# Altium schematic sheet Debugger & I2C.SchDoc
size A4; SheetNumber: 6; SheetTotal: 9
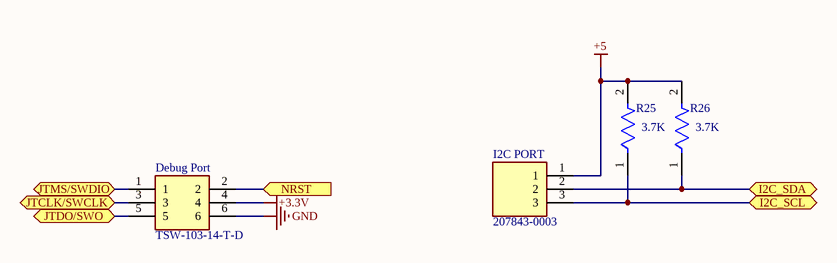
[diagram p0: Debugger & I2C.SchDoc]

## Parts
Debug_Port  TSW-103-14-T-D  [TSW-103-XX-YY-D]
I2C_PORT  207843-0003  [2078430003]
R25  3.7K  [FP-RN731J-MFG]
R26  3.7K  [FP-RN731J-MFG]

## Ports
I2C_SCL (bidir), I2C_SDA (bidir), JTCLK/SWCLK (bidir), JTDO/SWO (bidir), JTMS/SWDIO (bidir), NRST (in)

## Nets
+3.3V: Debug_Port.4
+5: I2C_PORT.1 R25.2 R26.2
GND: Debug_Port.6
I2C_SCL: I2C_PORT.3 R25.1 ; port I2C_SCL
I2C_SDA: I2C_PORT.2 R26.1 ; port I2C_SDA
JTCLK/SWCLK: Debug_Port.3 ; port JTCLK/SWCLK
JTDO/SWO: Debug_Port.5 ; port JTDO/SWO
JTMS/SWDIO: Debug_Port.1 ; port JTMS/SWDIO
NRST: Debug_Port.2 ; port NRST

## Library data of the parts
Debug_Port = TSW-103-14-T-D: Connector; Manufacturer_Name: SAMTEC; Datasheet Link: http://suddendocs.samtec.com/prints/tsw-xxx-xx-xxx-x-xx-xxx-mkt.pdf; Manufacturer_Part_Number: TSW-103-14-T-D
I2C_PORT = 207843-0003: Connector; Manufacturer_Name: Molex; Datasheet Link: https://www.molex.com/pdm_docs/sd/2078430003_sd.pdf; Height: 6.95mm; Manufacturer_Part_Number: 207843-0003
R25 R26 = CMP-04015-066978-1: 3.7kΩ ±0.25% 0.063W, 1/16W Chip Resistor 0603 (1608 Metric) Moisture Resistant Thin Film; Voltage Rating: 50V; Power Rating: 63mW; Temperature Coefficient: 10ppm/°C; Resistance: 3.7kR; Min Operating Temperature: -55°C; Packaging: Tape and Reel; Tolerance: 0.25%; Termination: SMD/SMT; Case/Package: 0603; Case Code (Metric): 1608; Case Code (Imperial): 0603; Composition: Thin Film; Max Operating Temperature: 125°C